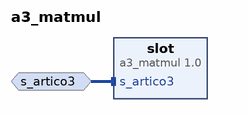
[diagram p0: block diagram of the top level]
# Vivado block design a3_matmul, xczu9eg-ffvb1156-2-i, Vivado 2017.1
create_bd_design a3_matmul

create_bd_intf_port -mode Slave -vlnv cei.upm.es:artico3:artico3_rtl:1.0 s_artico3

create_bd_cell -type ip -vlnv cei.upm.es:artico3:a3_matmul:1.0 slot

# ---- connections ----

connect_bd_intf_net -intf_net artico3_slot [get_bd_intf_ports s_artico3] [get_bd_intf_pins slot/s_artico3]

validate_bd_design
save_bd_design
